# Altium schematic sheet SAMV71_Xplained_Ultra_Memory.SchDoc: Memory
size A3; Organization: ATMEL Norway; Address1: Vestre Rosten 79; Address2: N-7075 TILLER; Address3: NORWAY; DocumentNumber: A09-2407; Revision: 2; SheetNumber: 9; SheetTotal: 13; PageSetup: Record=PageOptions|CenterHorizontal=True|CenterVertical=True|PrintScale=1.01|XCorrection=1.00|YCorrection=1.00|PrintKind=1|BorderSize=5000000|LeftOffset=0|BottomOffset=0|Orientation=2|PaperLength=1000|PaperWidth=1000|Scale=100|PaperSource=7|PrintQuality=-4|MediaType=1|DitherType=10|PaperKind=A3 (297 x 420 mm)|PrintScaleMode=1
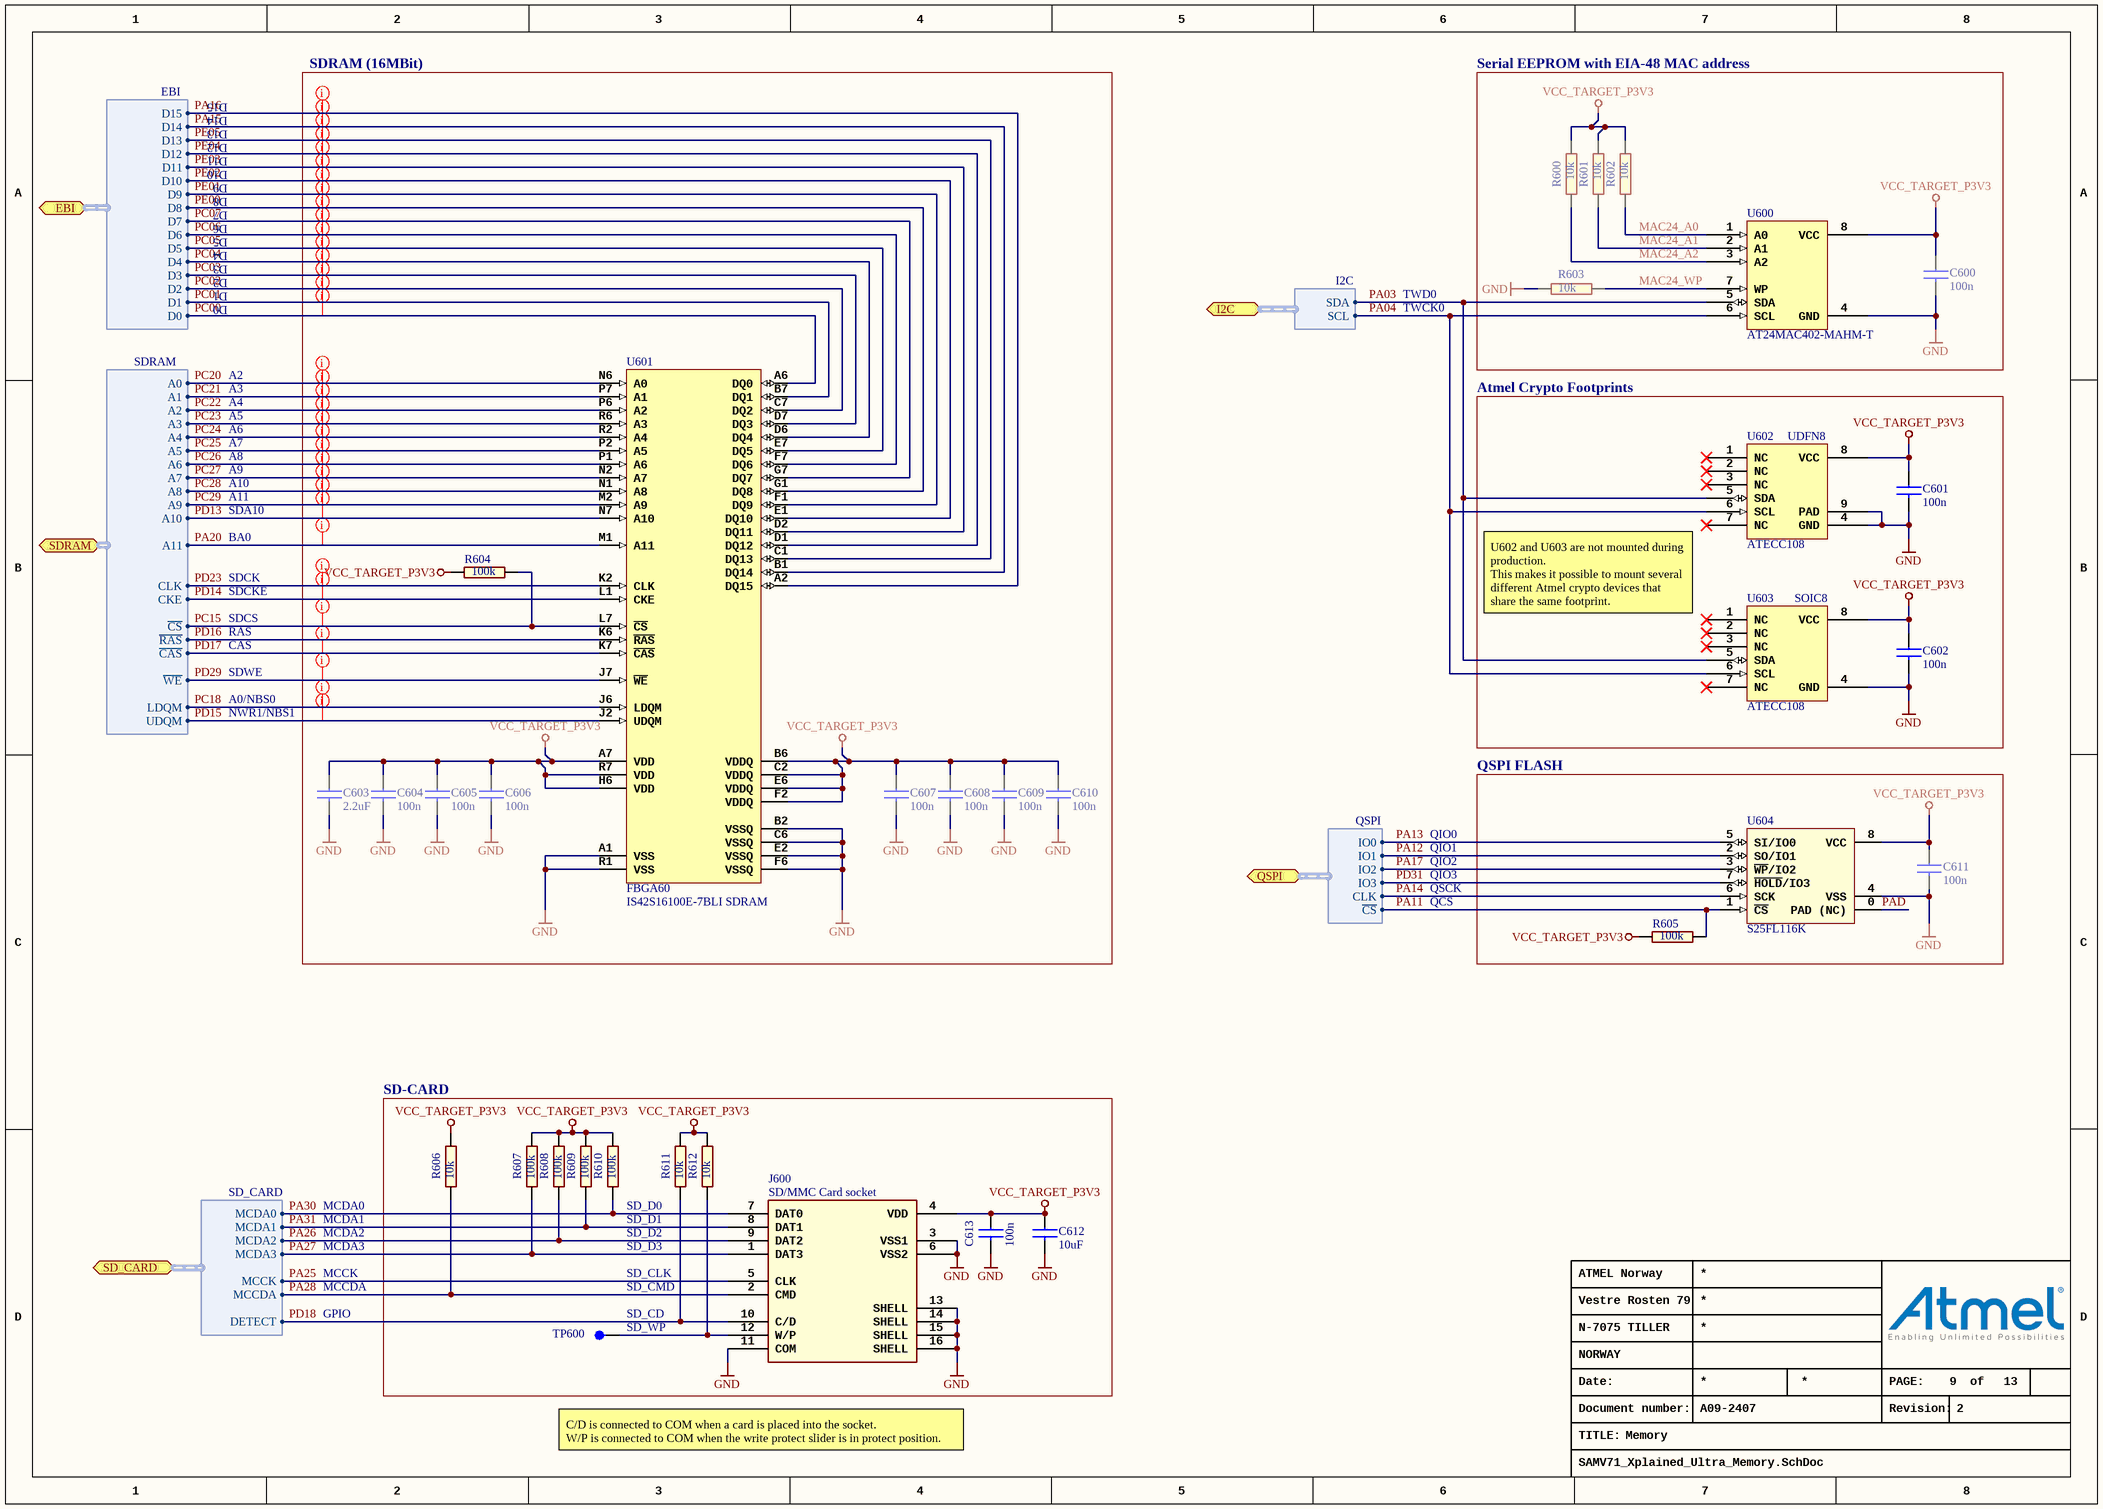
[diagram p0: SAMV71_Xplained_Ultra_Memory.SchDoc]

## Parts
C600  value 100n  [AP1-00001]  (hidden comment: CAP-NONPOL)
C601  value 100n  [AP1-00001]  (hidden comment: CAP-NONPOL)
C602  value 100n  [AP1-00001]  (hidden comment: CAP-NONPOL)
C603  value 2.2uF  [AP1-00053]  (hidden comment: Farnell no: 1288200)
C604  value 100n  [AP1-00053]  (hidden comment: CAP-NONPOL)
C605  value 100n  [AP1-00053]  (hidden comment: CAP-NONPOL)
C606  value 100n  [AP1-00053]  (hidden comment: CAP-NONPOL)
C607  value 100n  [AP1-00053]  (hidden comment: CAP-NONPOL)
C608  value 100n  [AP1-00053]  (hidden comment: CAP-NONPOL)
C609  value 100n  [AP1-00053]  (hidden comment: CAP-NONPOL)
C610  value 100n  [AP1-00053]  (hidden comment: CAP-NONPOL)
C611  value 100n  [AP1-00001]  (hidden comment: CAP-NONPOL)
C612  value 10uF  [AP1-00041]
C613  value 100n  [AP1-00001]  (hidden comment: CAP-NONPOL)
J600  SD/MMC Card socket  [AP8-00377]
R600  value 10k  [AP2-00000]  (hidden comment: R2)
R601  value 10k  [AP2-00000]  (hidden comment: R2)
R602  value 10k  [AP2-00000]  (hidden comment: R2)
R603  value 10k  [AP2-00000]  (hidden comment: R2)
R604  value 100k  [AP2-00000]  (hidden comment: R2)
R605  value 100k  [AP2-00000]  (hidden comment: R2)
R606  value 10k  [AP2-00000]  (hidden comment: R2)
R607  value 100k  [AP2-00000]  (hidden comment: R2)
R608  value 100k  [AP2-00000]  (hidden comment: R2)
R609  value 100k  [AP2-00000]  (hidden comment: R2)
R610  value 100k  [AP2-00000]  (hidden comment: R2)
R611  value 10k  [AP2-00000]  (hidden comment: R2)
R612  value 10k  [AP2-00000]  (hidden comment: R2)
TP600  TESTPOINT  [AP8-00010]  (value not drawn)  (no BOM)
U600  value AT24MAC402-MAHM-T  [AP6-00186]  (hidden comment: AT24MAC-8PIN)
U601  FBGA60  value IS42S16100E-7BLI SDRAM  [AP6-00400]
U602  value ATECC108  [AP6-00409]  (hidden comment: SOIC-8 / UDFN8 2x3mm (8MA2) footprint used for this component, usually for "not mounted" in schematics to support several Crypto devices.)
U603  value ATECC108  [AP6-00071]  (hidden comment: SOIC-8 / UDFN8 2x3mm (8MA2) footprint used for this component, usually for "not mounted" in schematics to support several Crypto devices.)
U604  value S25FL116K  [AP6-00402]  (hidden comment: Also available as 32- and 64-Mbit.)

## Blocks framed on the sheet
SDRAM (16MBit): C603-C610 R604 U601
Serial EEPROM with EIA-48 MAC address: C600 R600-R603 U600
Atmel Crypto Footprints: C601 C602 U602 U603
QSPI FLASH: C611 R605 U604
SD-CARD: C612 C613 J600 R606-R612 TP600

## Ports
EBI (harness EBI), I2C (harness I2C), QSPI (harness QSPI), SD_CARD (harness SD_CARD), SDRAM (harness SDRAM)

## Harnesses
SD_CARD: MCCDA, MCCK, MCDA3, MCDA2, MCDA1, MCDA0, DETECT
EBI: D0, D1, D2, D3, D4, D5, D6, D7, D8, D9, D10, D11, D12, D13, D14, D15
QSPI: CLK, IO3, IO2, IO0, IO1, ~{CS}
SDRAM: ~{CAS}, ~{RAS}, ~{CS}, CLK, CKE, ~{WE}, LDQM, UDQM, A0, A1, A2, A3, A4, A5, A6, A7, A8, A9, A10, A11
I2C: SDA, SCL

## Nets
GND: C600.2 C601.2 C602.2 C603.2 C604.2 C605.2 C606.2 C607.2 C608.2 C609.2 C610.2 C611.2 C612.2 C613.2 J600.3(VSS1) J600.6(VSS2) J600.11(COM) J600.13(SHELL) J600.14(SHELL) J600.15(SHELL) J600.16(SHELL) R603.1 U600.4(GND) U601.A1(VSS) U601.B2(VSSQ) U601.C6(VSSQ) U601.E2(VSSQ) U601.F6(VSSQ) U601.R1(VSS) U602.4(GND) U602.9(PAD) U603.4(GND) U604.4(VSS)
VCC_TARGET_P3V3: C600.1 C601.1 C602.1 C603.1 C604.1 C605.1 C606.1 C607.1 C608.1 C609.1 C610.1 C611.1 C612.1 C613.1 J600.4(VDD) R600.2 R601.2 R602.2 R604.1 R605.1 R606.2 R607.2 R608.2 R609.2 R610.2 R611.2 R612.2 U600.8(VCC) U601.A7(VDD) U601.B6(VDDQ) U601.C2(VDDQ) U601.E6(VDDQ) U601.F2(VDDQ) U601.H6(VDD) U601.R7(VDD) U602.8(VCC) U603.8(VCC) U604.8(VCC)
MAC24_A0: R602.1 U600.1(A0)
MAC24_A1: R601.1 U600.2(A1)
MAC24_A2: R600.1 U600.3(A2)
MAC24_WP: R603.2 U600.7(WP)
PA03: U600.5(SDA) U602.5(SDA) U603.5(SDA) ; port I2C.SDA
PA04: U600.6(SCL) U602.6(SCL) U603.6(SCL) ; port I2C.SCL
PA11: R605.2 U604.1(~{CS}) ; port QSPI.~{CS}
PA12: U604.2(SO/IO1) ; port QSPI.IO1
PA13: U604.5(SI/IO0) ; port QSPI.IO0
PA14: U604.6(SCK) ; port QSPI.CLK
PA15: U601.B1(DQ14) ; port EBI.D14
PA16: U601.A2(DQ15) ; port EBI.D15
PA17: U604.3(~{WP}/IO2) ; port QSPI.IO2
PA20: U601.M1(A11) ; port SDRAM.A11
PA25: J600.5(CLK) ; port SD_CARD.MCCK
PA26: J600.9(DAT2) R608.1 ; port SD_CARD.MCDA2
PA27: J600.1(DAT3) R607.1 ; port SD_CARD.MCDA3
PA28: J600.2(CMD) R606.1 ; port SD_CARD.MCCDA
PA30: J600.7(DAT0) R610.1 ; port SD_CARD.MCDA0
PA31: J600.8(DAT1) R609.1 ; port SD_CARD.MCDA1
PAD: U604.0(PAD_(NC))
PC00: U601.A6(DQ0) ; port EBI.D0
PC01: U601.B7(DQ1) ; port EBI.D1
PC02: U601.C7(DQ2) ; port EBI.D2
PC03: U601.D7(DQ3) ; port EBI.D3
PC04: U601.D6(DQ4) ; port EBI.D4
PC05: U601.E7(DQ5) ; port EBI.D5
PC06: U601.F7(DQ6) ; port EBI.D6
PC07: U601.G7(DQ7) ; port EBI.D7
PC15: R604.2 U601.L7(~{CS}) ; port SDRAM.~{CS}
PC18: U601.J6(LDQM) ; port SDRAM.LDQM
PC20: U601.N6(A0) ; port SDRAM.A0
PC21: U601.P7(A1) ; port SDRAM.A1
PC22: U601.P6(A2) ; port SDRAM.A2
PC23: U601.R6(A3) ; port SDRAM.A3
PC24: U601.R2(A4) ; port SDRAM.A4
PC25: U601.P2(A5) ; port SDRAM.A5
PC26: U601.P1(A6) ; port SDRAM.A6
PC27: U601.N2(A7) ; port SDRAM.A7
PC28: U601.N1(A8) ; port SDRAM.A8
PC29: U601.M2(A9) ; port SDRAM.A9
PD13: U601.N7(A10) ; port SDRAM.A10
PD14: U601.L1(CKE) ; port SDRAM.CKE
PD15: U601.J2(UDQM) ; port SDRAM.UDQM
PD16: U601.K6(~{RAS}) ; port SDRAM.~{RAS}
PD17: U601.K7(~{CAS}) ; port SDRAM.~{CAS}
PD18: J600.10(C/D) R611.1 ; port SD_CARD.DETECT
PD23: U601.K2(CLK) ; port SDRAM.CLK
PD29: U601.J7(~{WE}) ; port SDRAM.~{WE}
PD31: U604.7(~{HOLD}/IO3) ; port QSPI.IO3
PE00: U601.G1(DQ8) ; port EBI.D8
PE01: U601.F1(DQ9) ; port EBI.D9
PE02: U601.E1(DQ10) ; port EBI.D10
PE03: U601.D2(DQ11) ; port EBI.D11
PE04: U601.D1(DQ12) ; port EBI.D12
PE05: U601.C1(DQ13) ; port EBI.D13
NetJ600_12: J600.12(W/P) R612.1 TP600.1

Not connected (* = marked no-connect by the designer): U602 1(NC)* 2(NC)* 3(NC)* 7(NC)*; U603 1(NC)* 2(NC)* 3(NC)* 7(NC)*

## Layout directives
net class DATA_BUS: PA15, PA16, PC00, PC01, PC02, PC03, PC04, PC05, PC06, PC07, PC18, PD15, PE00, PE01, PE02, PE03, PE04, PE05
net class ADDRESS_BUS: PA20, PC15, PC20, PC21, PC22, PC23, PC24, PC25, PC26, PC27, PC28, PC29, PD13, PD14, PD17, PD23, PD29

## Notes on the sheet
- D14
- D15
- D9
- D10
- D11
- D12
- D13
- D4
- D5
- D6
- D7
- D8
- D0
- D1
- D2
- D3
- TWCK0
- TWD0
- A2
- A3
- A4
- A5
- A6
- A7
- (near U602) UDFN8
- A8
- A9
- A10
- A11
- SDA10
- BA0
- SDCK
- SDCKE
- SDCS
- RAS
- CAS
- U602 and U603 are not mounted during production.
  This makes it possible to mount several different Atmel crypto devices that share the same footprint.
- (near U603) SOIC8
- A0/NBS0
- NWR1/NBS1
- SDWE
- QIO0
- QIO1
- QIO2
- QIO3
- QSCK
- QCS
- MCDA0
- MCDA1
- MCDA2
- MCDA3
- SD_D0
- SD_D1
- SD_D2
- SD_D3
- GPIO
- MCCK
- MCCDA
- SD_CLK
- (near TP600) SD_CMD
- (near TP600) SD_CD
- (near TP600) SD_WP
- C/D is connected to COM when a card is placed into the socket.
  W/P is connected to COM when the write protect slider is in protect position.
- Date:
- PAGE:
- of
- TITLE:
- Document number:
- Revision:

## Library data of the parts
C600-C602 C604-C611 C613 = A01-0246: Ceramic capacitor, SMD 0402, X7R, 16V, +/-10%; PartGroup: Capacitors,Ceramic,SMD 0402; Manufacturer: Kemet; MPN: C0402C104K4RACTU; TemperatureRange: -55 - +125 deg C; AN: A01-0246; Tolerance: 16V, +/-10%
  C600-C602 C604-C611: Height: 0.5
  C613: Height: 0,5
C603 = A01-0300: Ceramic capacitor, SMD 0402, X5R, 6.3V, +/-20%; PartGroup: Capacitors,Ceramic,SMD 0402; Manufacturer: Kemet; MPN: C0402C225M9PAC; Tolerance: Â±20%; TemperatureRange: -55Â°C to +85Â°C; AN: A01-0300; Height: 0.5
C612 = A01-0360: Ceramic capacitor, SMD 0805, X5R, 10V, 10 %, (de19441); PartGroup: Capacitors,Ceramic,SMD 0805; Manufacturer: Murata; MPN: GRM21BR61A106KE19L; Tolerance: 10%; TemperatureRange: -55 - +85 deg C; AN: A01-0360; Height: 1,25
J600 = A08-0816: SD/MMC socket, 2.7mm, push-push, SMD; PartGroup: Mechanical devices,Connectors,Memory cards; Manufacturer: Kyocera-elco; Value: KYOCERA - 14 5738 009 220 859+; TemperatureRange: -25 deg C to 90 deg C; AN: A08-0816; Height: 2.70000004768372; MPN: KYOCERA - 14 5738 009 220 859+
R600-R603 = A02-0236: Thick film resistor, SMD 0402, 1/16W, 1%; PartGroup: Resistors,SMD,0402 1%; Manufacturer: vishay; MPN: CRCW040210K0FKED; TemperatureRange: -55 - +125 deg C; AN: A02-0236; Tolerance: 1 %; Height: 0,349999994039536
R604 R605 = A02-0260: Thick film resistor, SMD 0402, 1/16W, 1%; PartGroup: Resistors,SMD,0402 1%; TemperatureRange: -55ï¿½ to +125ï¿½C; AN: A02-0260; Tolerance: 1 %; Height: 0.349999994039536
R606 R611 R612 = A02-0236: Thick film resistor, SMD 0402, 1/16W, 1%; PartGroup: Resistors,SMD,0402 1%; TemperatureRange: -55 - +125 deg C; AN: A02-0236; Tolerance: 1 %; Height: 0.349999994039536
R607-R610 = A02-0260: Thick film resistor, SMD 0402, 1/16W, 1%; PartGroup: Resistors,SMD,0402 1%; TemperatureRange: -55 - +125 deg C; AN: A02-0260; Tolerance: 1 %; Height: 0.349999994039536
TP600 = A08-0004: Single SMD testpad; PartGroup: Mechanical devices,Connectors,Test points; AN: A08-0004; Value: TESTPAD; Height: 0
U600 = A06-1169: 2kbit I2C EEPROM, single EUI-48 MAC, 1.7-5.5V, 2x3mm UDFN (8MA2); PartGroup: Integrated Circuits,Memory,EEPROM; TemperatureRange: â€“40Â°C to +85Â°C; AN: A06-1169; Height: 0,600000023841858
U601 = A06-1155: 16Mbit  SDRAM (512K Words x 16 Bits x 2 Banks), 143 MHz 3,3V; PartGroup: Integrated Circuits,Memory,SDRAM; TemperatureRange: -40C to +85C; AN: A06-1155; Height: 1,20000004768372
U602 = A06-1181: Secure authentication and product validation device, EEPROM, I2C, 2.0 - 5.5V, UDFN8; PartGroup: Integrated Circuits,Special function,Encryption; TemperatureRange: -40Â°C to +85Â°C; AN: A06-1181; Height: 1,75
U603 = A06-1182: Secure authentication and product validation device, EEPROM, I2C, 2.0 - 5.5V, SOIC8; PartGroup: Integrated Circuits,Special function,Encryption; TemperatureRange: -40Â°C to +85Â°C; AN: A06-1182; Height: 1,75
U604 = A06-1162: 16 Mbit (2MB) SPI Quad I/O flash, 3.3V, 108MHz, WSON-8, industrial temperature; PartGroup: Integrated Circuits,Memory,FLASH; TemperatureRange: -40Â°C to +85Â°C; AN: A06-1162; Height: 0,800000011920929